# EAGLE design Low-Frequency-LC-Oscillator (EAGLE 7.7.0)
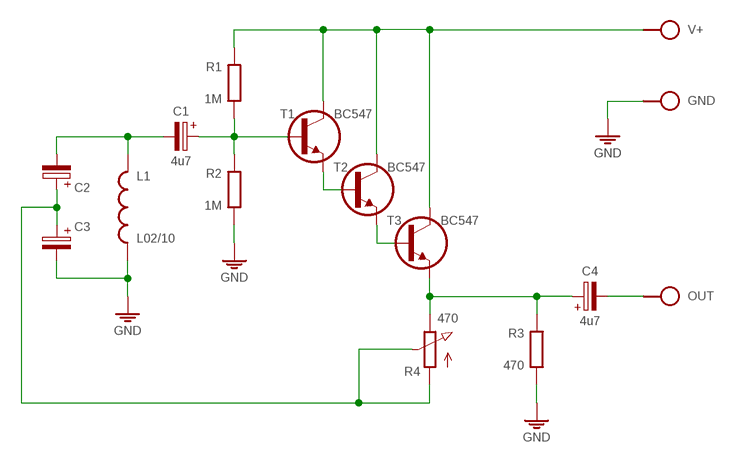
[diagram p0: schematic, sheet 1]

## Parts
C1  4u7  CPOLE2,5-3  [E2,5-3]
C2  CPOLE2.5-5  [E2,5-5]
C3  CPOLE2.5-5  [E2,5-5]
C4  4u7  CPOLE2,5-3  [E2,5-3]
GND  SPAD  [SPAD]
L1  L02/10  [L-03/10V]
OUT  SPAD  [SPAD]
R1  1M  R0204/10  [0204/10]
R2  1M  R0204/10  [0204/10]
R3  470  R0204/10  [0204/10]
R4  470  POT  [POT]
T1  BC547  BC547CBE  [TO92-CBE]
T2  BC547  BC547CBE  [TO92-CBE]
T3  BC547  BC547CBE  [TO92-CBE]
V+  SPAD  [SPAD]

## Nets
GND: C3.- GND.1 L1.2 R2.1 R3.1
N$1: R1.2 T1.C T2.C T3.C V+.1
N$2: C4.- OUT.1
N$5: C4.+ R3.2 R4.3(E) T3.E
N$6: T1.E T2.B
N$7: T2.E T3.B
N$8: C1.- C2.- L1.1
N$9: C1.+ R1.1 R2.2 T1.B
N$10: C2.+ C3.+ R4.1(A) R4.2(S)

## Library data of the parts
C1-C4 = c:CPOL: POLARIZED CAPACITOR, European symbol
GND OUT V+ = pad:SPAD
L1 = r:L
R1-R3 = r:R: RESISTOR, European symbol
R4 = r:POT
T1-T3 = t:BC547

## Board
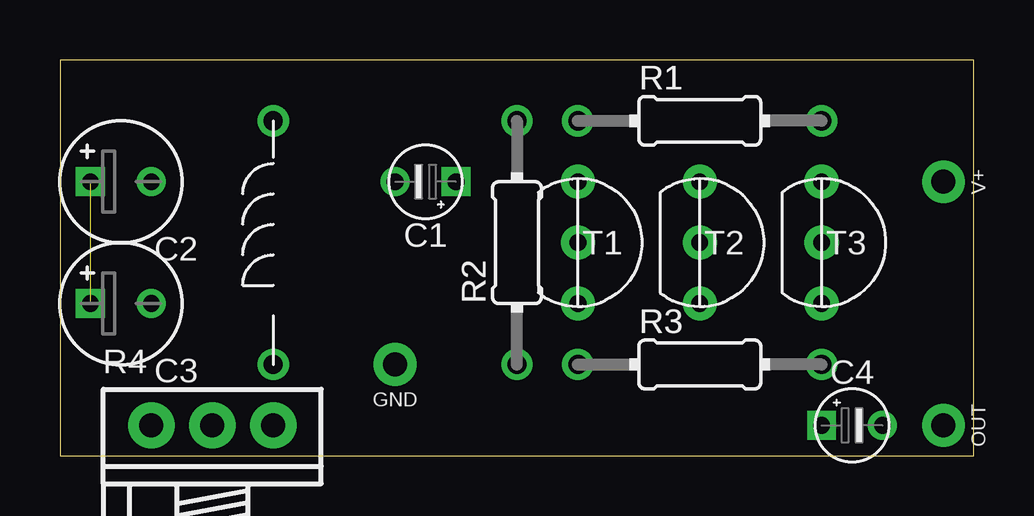
[diagram p1: board, top side]
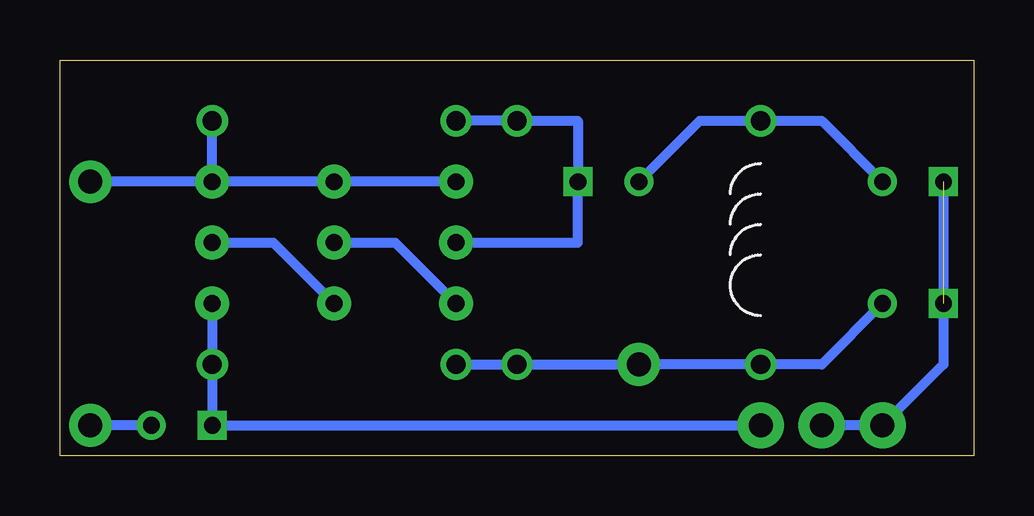
[diagram p2: board, bottom side, seen from below]

Size 38.1 x 16.51 mm. Coordinates in mm from the lower left corner, seen from the top.
Outline: 0,0 38.1,0 38.1,16.51 0,16.51 0,0
Copper layers (1*16): Top 0.035mm / dielectric 1.5mm / Bottom 0.035mm
Design rules "default": minimum track width 10mil, minimum drill 24mil, track to track 8mil, track to pad 8mil, pad to pad 8mil, via to via 8mil, smd to smd 8mil, copper to edge 40mil, drill to drill 8mil, minimum pad ring 10mil, minimum via ring 8mil, stop-mask expansion 4mil, vias tented up to drill 0mil, thermal gap 10mil

### Footprints (pad centres in the part's own frame; a part is rotated, then mirrored left to right if it is on the bottom)
E2,5-3 = drill 0.7 square: + 0,1.27 | drill 0.7: - 0,-1.27
E2,5-5 = drill 0.7 square: + 1.27,0 | drill 0.7: - -1.27,0
SPAD = drill 1 pad 1.778: 1 0,0
L-03/10V = drill 0.8: 1 0,5.08; 2 0,-5.08
0204/10 = drill 0.8: 1 -5.08,0; 2 5.08,0
POT = drill 1 pad 1.93: 1 -2.54,0; 2 0,0; 3 2.54,0
TO92-CBE = drill 0.7 pad 1.422: B 0,0; C 0,2.54; E 0,-2.54

### Placement (x,y rotation side)
C1  15.24,11.43 270 top
C2  2.54,11.43 180 top
C3  2.54,6.35 180 top
C4  33.02,1.27 90 top
GND  13.97,3.81 90 top
L1  8.89,8.89 0 top
OUT  36.83,1.27 180 top
R1  26.67,13.97 0 top
R2  19.05,8.89 90 top
R3  26.67,3.81 0 top
R4  6.35,1.27 0 top
T1  21.59,8.89 0 top
T2  26.67,8.89 0 top
T3  31.75,8.89 0 top
V+  36.83,11.43 180 top

### Tracks (layer width: path | path; a pad name or v marks a point on that pad's centre or on a via)
GND
  Bottom 0.406: C3.- 6.35,3.81 L1.2 GND.1 R2.1 R3.1
N$1
  Bottom 0.406: T3.C V+.1 | T3.C T2.C T1.C | T3.C R1.2
N$2
  Bottom 0.406: C4.- OUT.1
N$5
  Bottom 0.406: T3.E R3.2 C4.+ R4.3
N$6
  Bottom 0.406: T2.B 24.13,8.89 T1.E
N$7
  Bottom 0.406: T3.B 29.21,8.89 T2.E
N$8
  Bottom 0.406: C1.- 11.43,13.97 L1.1 6.35,13.97 C2.-
N$9
  Bottom 0.406: T1.B 16.51,8.89 C1.+ 16.51,13.97 R2.2 R1.1
N$10  (1 unrouted)
  Bottom 0.406: C2.+ 1.27,3.81 R4.1 R4.2